# EAGLE design attinier84-avrisp-shield-mk-1.0 (EAGLE 6.5.0)
REVISION: 3.0
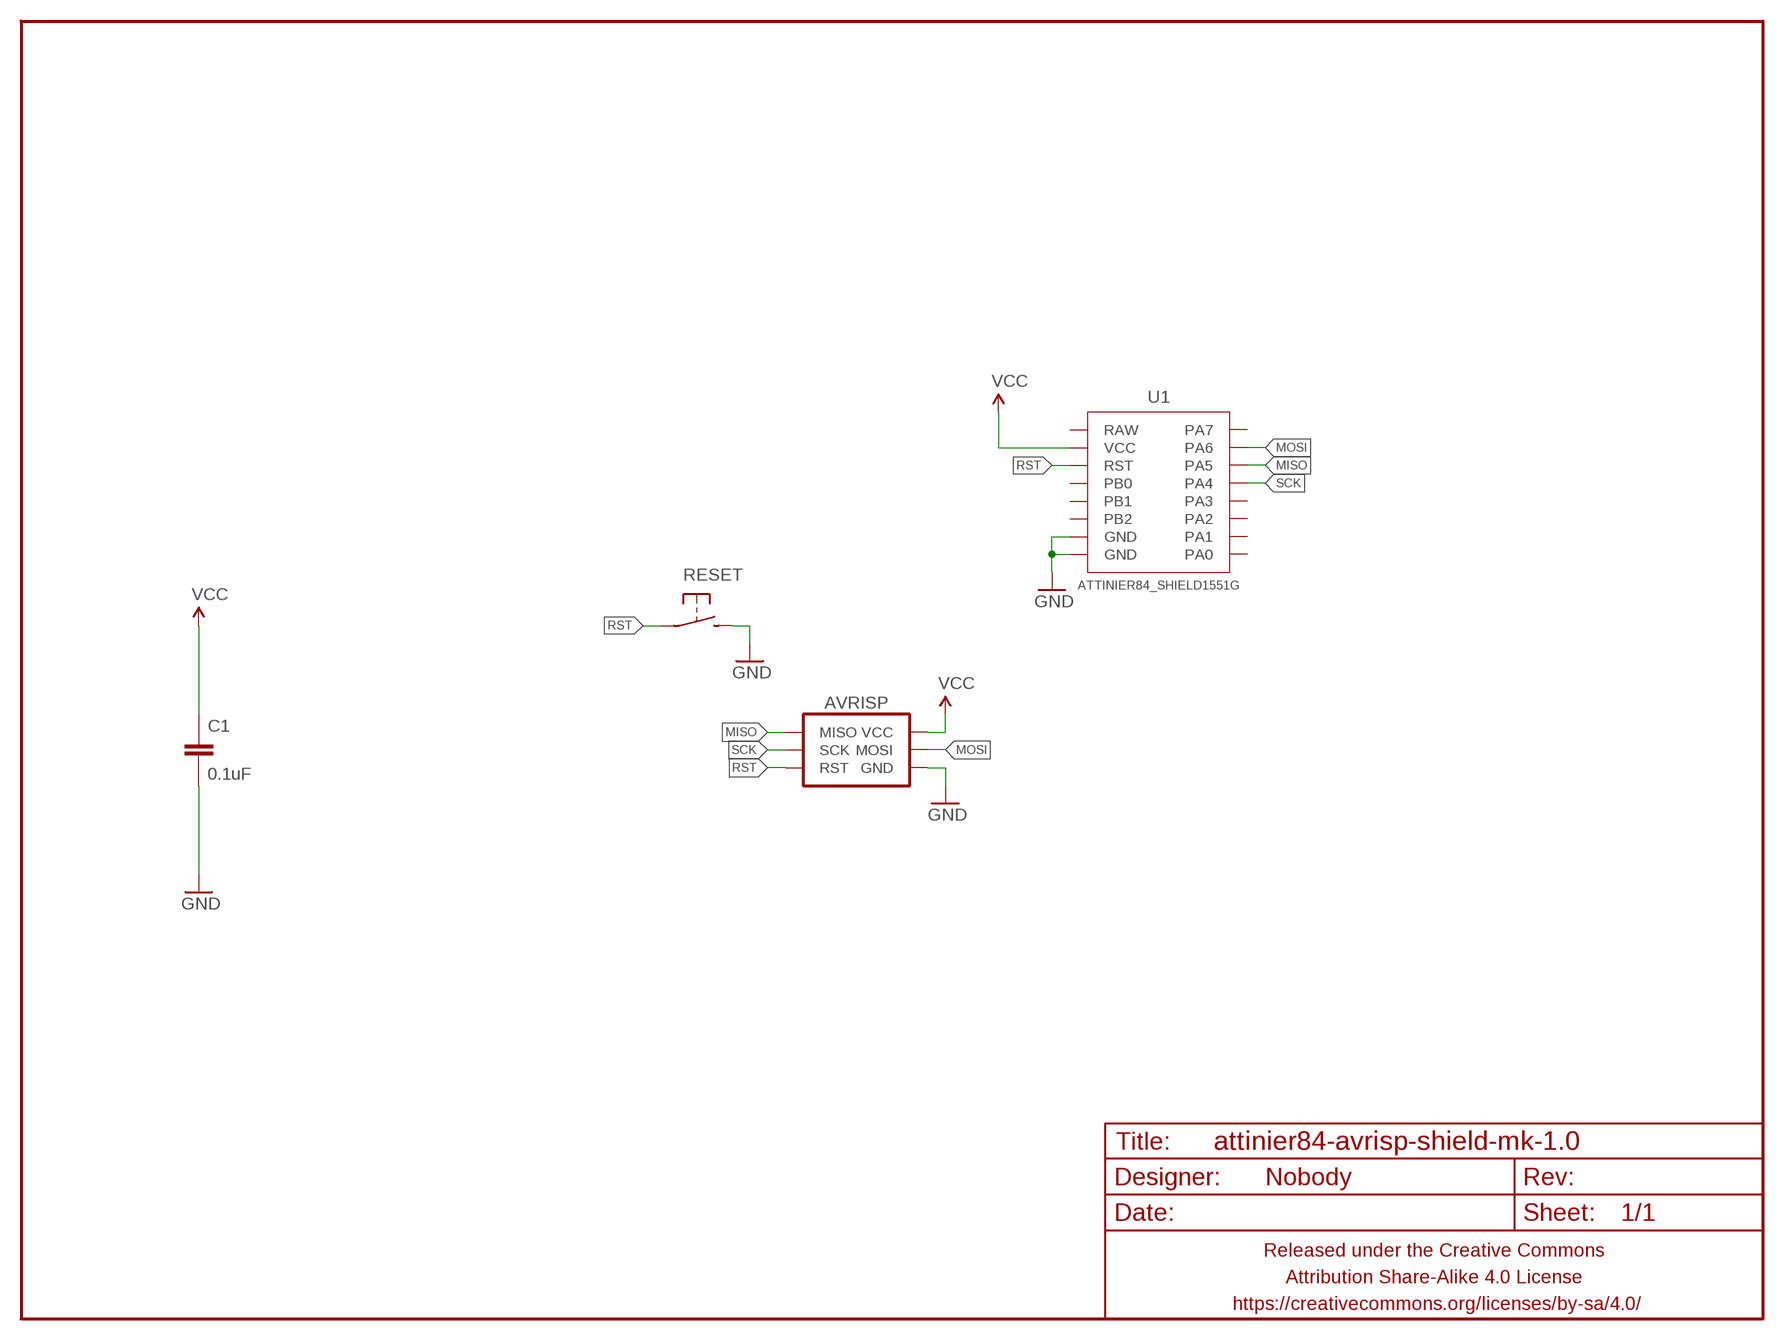
[diagram p0: schematic, sheet 1]

## Parts
AVRISP  AVR_SPI_PRG_6PTH-SHROUD  [2X3-SHROUDED]
C1  0.1uF  CAPACITOR-CERAMIC025-024X044  [C025-024X044]
FRAME1  FRAME-LETTERNO_PACKAGE  [DUMMY]
RESET  SPST-NO-TACT6MM-PTH-SMALL-PADS  [DTS-6-SMALL-PADS]
U1  ATTINIER84_SHIELD1551G  [ATTINIER84_SHIELD2]

## Nets
GND: AVRISP.6(GND) C1.2 RESET.3 RESET.4 U1.GND@1(GND) U1.GND@2(GND)
MISO: AVRISP.1(MISO) U1.PA5
MOSI: AVRISP.4(MOSI) U1.PA6
RST: AVRISP.5(RST) RESET.1 RESET.2 U1.RST
SCK: AVRISP.3(SCK) U1.PA4
VCC: AVRISP.2(VCC) C1.1 U1.VCC
Unconnected: U1.PA0 U1.PA1 U1.PA2 U1.PA3 U1.PA7 U1.PB0 U1.PB1 U1.PB2 U1.RAW

## Library data of the parts
AVRISP = A_butts:AVR_SPI_PRG_6: AVR ISP 6 Pin This is the reduced ISP connector for AVR programming. Common on Arduino. This footprint will take up less PCB space and can be used with a 10-pin to 6-pin adapter such as SKU: BOB-08508 **Special note about "TEST_POINT" package. The stop mask is on the top side, so if you want your programming test points to be on the bottom of your board, make sure to place this package on the bottom side of the board. This also ensure that the orientation to program from the bottom side will be correct.
C1 = A_butts:CAPACITOR-CERAMIC: CAPACITOR, European symbol
FRAME1 = A_butts:FRAME-LETTER: Schematic Frame Standard 8.5x11 US Letter frame; DESIGNER: Nobody
RESET = A_butts:SPST-NO-TACT
U1 = A_butts:ATTINIER84_SHIELD

## Board
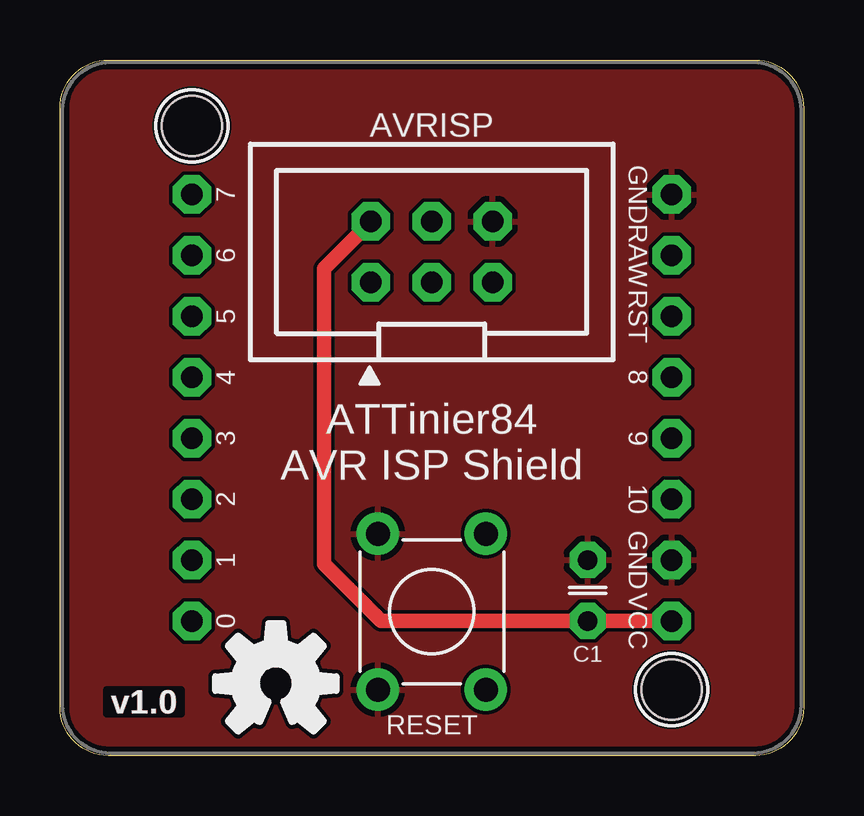
[diagram p1: board, top side]
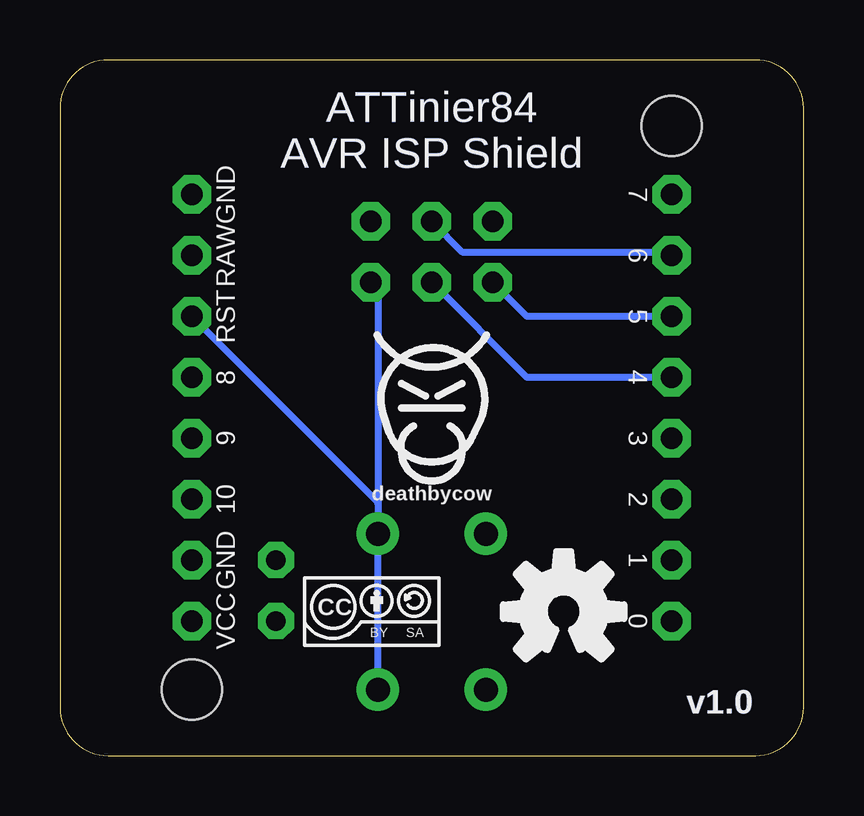
[diagram p2: board, bottom side, seen from below]

Size 31 x 29 mm. Coordinates in mm from the lower left corner, seen from the top.
Outline: 29,0 2,0 arc-90 0,2 0,27 arc-90 2,29 29,29 arc-90 31,27 31,2 arc-90 29,0
Copper layers (1*16): Top 0.0356mm / dielectric 1.5011mm / Bottom 0.0356mm
Design rules "LaenPCBOrder_2": minimum track width 6mil, minimum drill 13mil, track to track 6mil, track to pad 6mil, pad to pad 6mil, via to via 6mil, smd to smd 6mil, copper to edge 15mil, drill to drill 6mil, minimum pad ring 7mil, minimum via ring 7mil, stop-mask expansion 3mil, vias tented up to drill 20mil, thermal gap 10mil

### Footprints (pad centres in the part's own frame; a part is rotated, then mirrored left to right if it is on the bottom)
2X3-SHROUDED = drill 0.9 pad 1.6 octagon: 1 -1.27,2.54; 2 1.27,2.54; 3 -1.27,0; 4 1.27,0; 5 -1.27,-2.54; 6 1.27,-2.54
C025-024X044 = drill 0.813 pad 1.5 octagon: 1 -1.27,0; 2 1.27,0
DTS-6-SMALL-PADS = drill 1 pad 1.778: 1 -3.25,2.25; 2 3.25,2.25; 3 -3.25,-2.25; 4 3.25,-2.25
ATTINIER84_SHIELD2 = drill 0.9 pad 1.6 octagon: GND@1 10,-6.35; GND@2 10,8.89; PA0 -10,-8.89; PA1 -10,-6.35; PA2 -10,-3.81; PA3 -10,-1.27; PA4 -10,1.27; PA5 -10,3.81; PA6 -10,6.35; PA7 -10,8.89; PB0 10,-3.81; PB1 10,-1.27; PB2 10,1.27; RAW 10,6.35; RST 10,3.81; VCC 10,-8.89 | hole 2.5: -10,11.75; 10,-11.75

### Placement (x,y rotation side)
AVRISP  15.5,21 90 top
C1  22,6.88 90 top
FRAME1  0,0 0 top
RESET  15.5,6 270 top
U1  15.5,14.5 0 top
U$1  [CC-BY-SA-4.0-NO-URL]  18,6 0 bottom
U$2  [COW_SMALL]  15.5,15 0 bottom
U$3  [OSHWLOGO_BOT_0.2_A]  10,6 0 top
U$4  [OSHWLOGO_BOT_0.2_A]  9,3 0 bottom

### Tracks (layer width: path | path; a pad name or v marks a point on that pad's centre or on a via)
GND
  pour Top: -0.1,-0.1 -0.1,29.1 31.1,29.1 31.1,-0.1
MISO
  Bottom 0.3: U1.PA5 11.54,18.31 AVRISP.1
MOSI
  Bottom 0.3: AVRISP.4 14.23,21 5.65,21 U1.PA6
RST
  Bottom 0.3: RESET.2 RESET.1 17.75,10.5 17.75,10.56 | U1.RST 17.75,10.56 | AVRISP.5 17.75,19.44 17.75,10.56
SCK
  Bottom 0.3: U1.PA4 11.54,15.77 AVRISP.3
VCC
  Top 0.6: AVRISP.2 11,20.31 11,8 13.39,5.61 C1.1 U1.VCC

### Text on the board
Bottom: ATTinier84 / AVR ISP Shield
tPlace: ATTinier84 / AVR ISP Shield
bPlace: ATTinier84 / AVR ISP Shield